# EAGLE design cubex_camera (EAGLE 6.4)
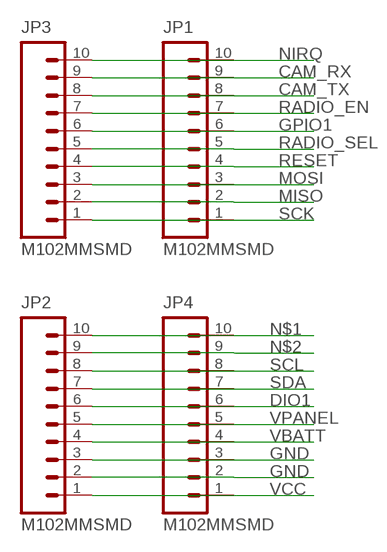
[diagram p0: schematic, sheet 1]

## Parts
JP1  M102MMSMD  [1X10-2MM-SMD]
JP2  M102MMSMD  [1X10-2MM-SMD]
JP3  M102MMSMD  [1X10-2MM-SMD]
JP4  M102MMSMD  [1X10-2MM-SMD]

## Nets
CAM_RX: JP1.9 JP3.9
CAM_TX: JP1.8 JP3.8
DIO1: JP2.6 JP4.6
GND: JP2.2 JP2.3 JP4.2 JP4.3
GPIO1: JP1.6 JP3.6
MISO: JP1.2 JP3.2
MOSI: JP1.3 JP3.3
N$1: JP2.10 JP4.10
N$2: JP2.9 JP4.9
NIRQ: JP1.10 JP3.10
RADIO_EN: JP1.7 JP3.7
RADIO_SEL: JP1.5 JP3.5
RESET: JP1.4 JP3.4
SCK: JP1.1 JP3.1
SCL: JP2.8 JP4.8
SDA: JP2.7 JP4.7
VBATT: JP2.4 JP4.4
VCC: JP2.1 JP4.1
VPANEL: JP2.5 JP4.5

## Library data of the parts
JP1-JP4 = SparkFun:M10: Header 10 Standard 10-pin 0.1" header. Use with straight break away headers (SKU : PRT-00116), right angle break away headers (PRT-00553), swiss pins (PRT-00743), machine pins (PRT-00117), and female headers (PRT-00115).

## Board
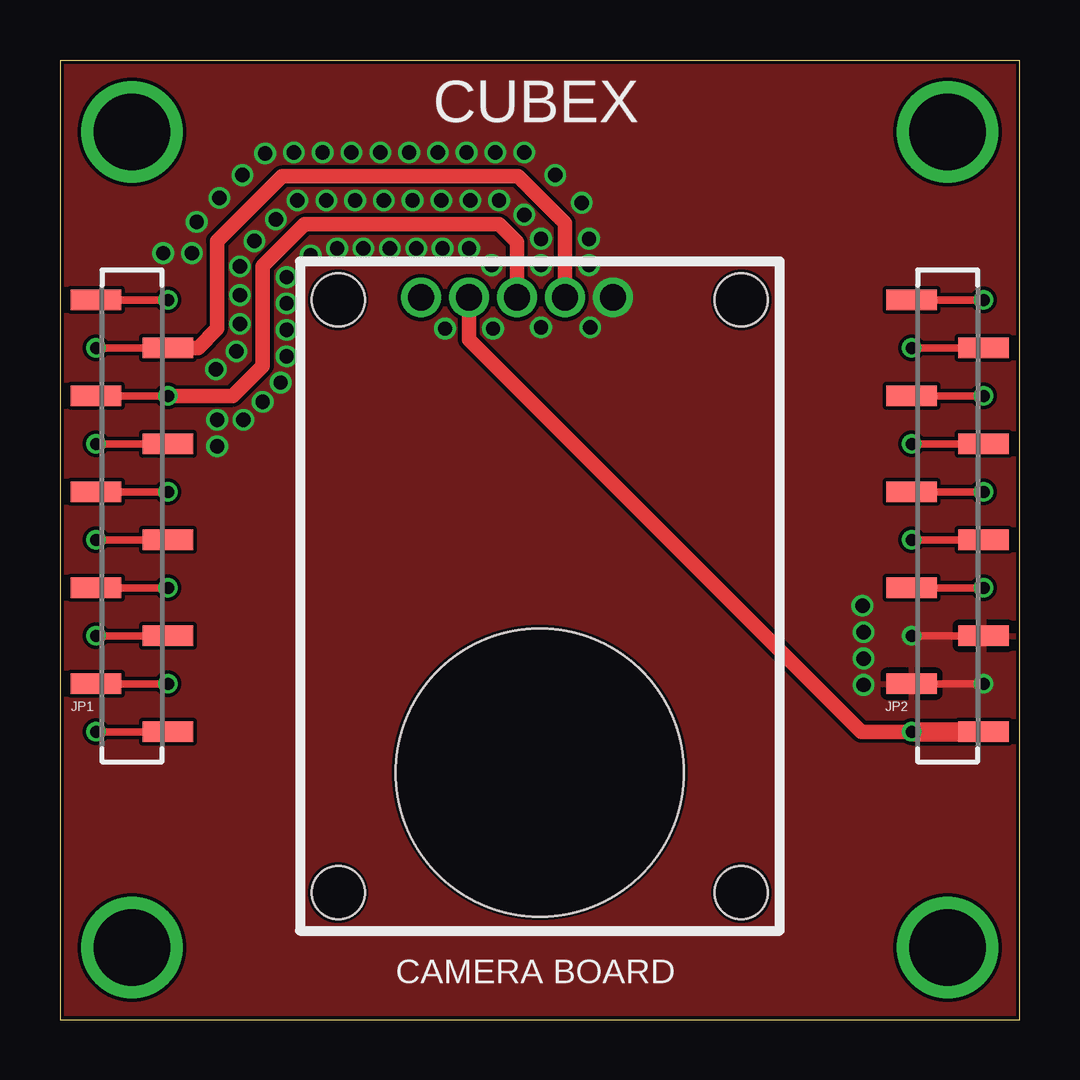
[diagram p1: board, top side]
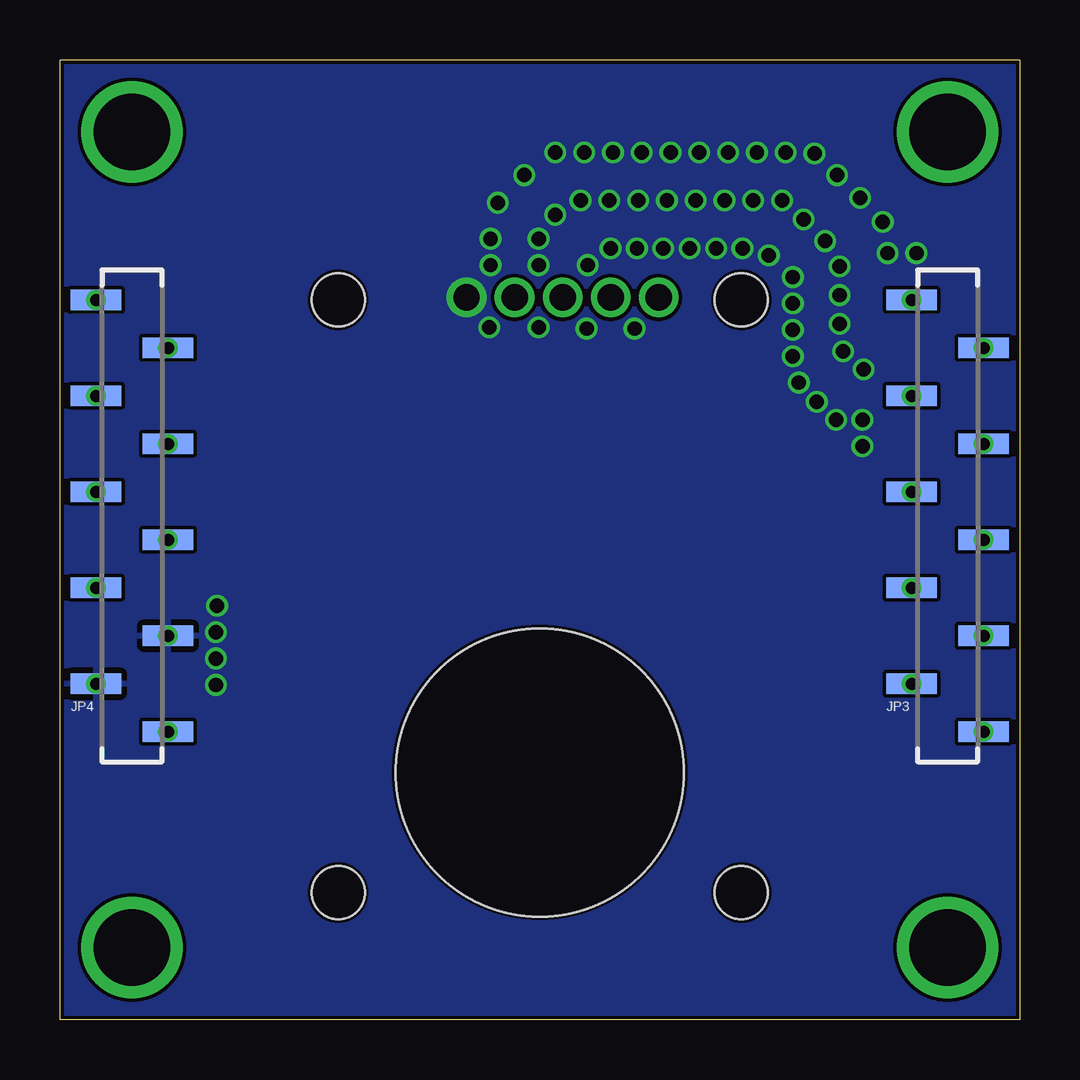
[diagram p2: board, bottom side, seen from below]

Size 40 x 40 mm. Coordinates in mm from the lower left corner, seen from the top.
Outline: 0,0 40,0 40,40 0,40 0,0
Copper layers (1*16): Top 0.035mm / dielectric 1.5mm / Bottom 0.035mm
Design rules "hackvana": minimum track width 6mil, minimum drill 0.3mm, track to track 6mil, track to pad 6mil, pad to pad 6mil, via to via 6mil, smd to smd 0mil, copper to edge 6mil, drill to drill 6mil, minimum pad ring 10mil, minimum via ring 6mil, stop-mask expansion 2mil, vias tented up to drill 100mil, thermal gap 10mil
Holes 2.2 mm at 11.6,30 28.4,30 11.6,5.29 28.4,5.29
Holes 12 mm at 20,10.3

### Footprints (pad centres in the part's own frame; a part is rotated, then mirrored left to right if it is on the bottom)
1X10-2MM-SMD = smd 0.85 x 2.1: 1 0,-1.5; 2 2,1.5; 3 4,-1.5; 4 6,1.5; 5 8,-1.5; 6 10,1.5; 7 12,-1.5; 8 14,1.5; 9 16,-1.5; 10 18,1.5

### Placement (x,y rotation side)
JP1  3,12 90 top
JP2  37,12 90 top
JP3  3,12 90 bottom
JP4  37,12 90 bottom

### Tracks (layer width: path | path; a pad name or v marks a point on that pad's centre or on a via)
CAM_RX  (via drill 0.5, 1.1)
  Top 0.305: JP1.9 JP3.9
  Top 0.61: v21.05,30.1 21.05,33.2 19.1,35.15 9.25,35.15 6.55,32.45 6.55,28.8 5.75,28 JP1.9
  other vias: 1.5,28
CAM_TX  (via drill 0.5, 1.1)
  Top 0.305: JP1.8 JP3.8
  Top 0.61: v19.05,30.1 19.05,32.4 18.3,33.15 10.2,33.15 8.45,31.4 8.45,27.25 7.2,26 JP3.8
  other vias: 4.5,26
DIO1  (via drill 0.5)
  Top 0.305: JP2.6 JP4.6
  other vias: 38.5,22
GND  (via drill 0.5, 0.6, 1.1)
  Top 0.305: JP2.2 JP4.2 | JP2.3 JP4.3
  other vias: 38.5,14 35.5,16 23.05,30.1 6.55,25 8.1,32.45 7.35,27.85 19.35,33.55 18.3,34.15 17.1,34.15 15.9,34.15 13.5,34.15 9.9,34.15 6.5,27.1 9.45,29.85 18,31.45 22.05,32.55 20.65,35.2 19.35,36.15 18.15,36.15 9.75,36.15 8.55,36.1 22.05,31.45 12.15,36.15 16.95,36.15 22.1,28.85 33.5,16.15 9.45,27.65 11.55,32.15 15.95,32.15 18.05,28.8 9,33.35 14.7,34.15 20.05,31.45 20.05,32.55 11.1,34.15 7.5,30.2 9.2,26.55 33.5,15.05 33.45,17.25 13.75,32.15 14.85,32.15 4.3,31.95 16.05,28.8 21.75,34.05 13.35,36.15 15.75,36.15 14.55,36.15 10.95,36.15 5.5,31.95 8.45,25.75 12.65,32.15 10.45,31.85 9.45,28.75 7.65,25 6.55,23.9 9.45,30.95 17.05,32.15 7.5,29 7.5,31.4 12.3,34.15 7.6,35.2 6.65,34.25 5.7,33.25 20.05,28.85 33.5,13.95
  pour Top: 0,40 40,40 40,0 0,0
  pour Bottom: 0,40 40,40 40,0 0,0
GPIO1  (via drill 0.5)
  Top 0.305: JP1.6 JP3.6
  other vias: 4.5,22
MISO  (via drill 0.5)
  Top 0.305: JP1.2 JP3.2
  other vias: 4.5,14
MOSI  (via drill 0.5)
  Top 0.305: JP1.3 JP3.3
  other vias: 1.5,16
N$1  (via drill 0.5)
  Top 0.305: JP4.10 JP2.10
  other vias: 38.5,30
N$2  (via drill 0.5)
  Top 0.305: JP4.9 JP2.9
  other vias: 35.5,28
N$5  (via drill 3.2)
  other vias: 3,3
N$7  (via drill 3.2)
  other vias: 37,3
N$8  (via drill 3.2)
  other vias: 37,37
N$12  (via drill 3.2)
  other vias: 3,37
NIRQ  (via drill 0.5)
  Top 0.305: JP1.10 JP3.10
  other vias: 4.5,30
RADIO_EN  (via drill 0.5)
  Top 0.305: JP1.7 JP3.7
  other vias: 1.5,24
RADIO_SEL  (via drill 0.5)
  Top 0.305: JP1.5 JP3.5
  other vias: 1.5,20
RESET  (via drill 0.5)
  Top 0.305: JP1.4 JP3.4
  other vias: 4.5,18
SCK  (via drill 0.5)
  Top 0.305: JP1.1 JP3.1
  other vias: 1.5,12
SCL  (via drill 0.5)
  Top 0.305: JP2.8 JP4.8
  other vias: 38.5,26
SDA  (via drill 0.5)
  Top 0.305: JP2.7 JP4.7
  other vias: 35.5,24
VBATT  (via drill 0.5)
  Top 0.305: JP2.4 JP4.4
  other vias: 38.5,18
VCC  (via drill 0.5, 1.1)
  Top 0.61: JP4.1 33.4,12 17.05,28.35 v17.05,30.1
  Top 0.813: JP4.1 JP2.1
  other vias: 35.5,12
VIDEO  (via drill 1.1)
  other vias: 15.05,30.1
VPANEL  (via drill 0.5)
  Top 0.305: JP2.5 JP4.5
  other vias: 35.5,20

### Text on the board
tNames: CUBEX | CAMERA BOARD